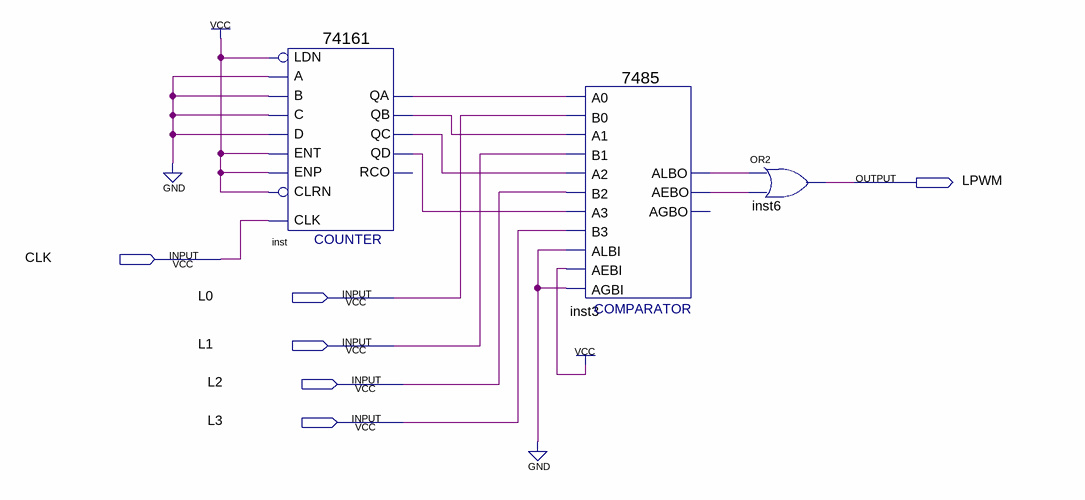
[diagram p0: schematic sheet]
// Quartus schematic LPWM.bdf as structural Verilog: 3 symbols, 6 pins
module LPWM (
  input  CLK,
  input  L0,
  input  L1,
  input  L2,
  input  L3,
  output LPWM
);

  wire inst3_aebo, inst3_albo, inst_qa, inst_qb, inst_qc, inst_qd;

  \74161  inst (
    .CLRN(1'b1), .CLK(CLK), .ENP(1'b1), .LDN(1'b1), .A(1'b0), .D(1'b0), .ENT(1'b1), .B(1'b0), .C(1'b0),
    .QD(inst_qd), .QC(inst_qc), .QB(inst_qb), .QA(inst_qa));  // open: RCO
  \7485  inst3 (
    .A3(inst_qd), .B2(L2), .A2(inst_qc), .AEBI(1'b1), .AGBI(1'b0), .ALBI(1'b0), .A0(inst_qa), .B0(L0),
    .B3(L3), .A1(inst_qb), .B1(L1), .ALBO(inst3_albo), .AEBO(inst3_aebo));  // open: AGBO
  or inst6 (LPWM, inst3_albo, inst3_aebo);
endmodule
